# EasyEDA Pro project PowerControl.eprj

# Schematic Schematic16
Create Date: 2024-04-26; Page Name: P1; Project Name: PowerControl; Schematic Name: Schematic16; Update Date: 2024-07-27; Company: 嘉立创EDA; Page Size: A4; Version: V1.0
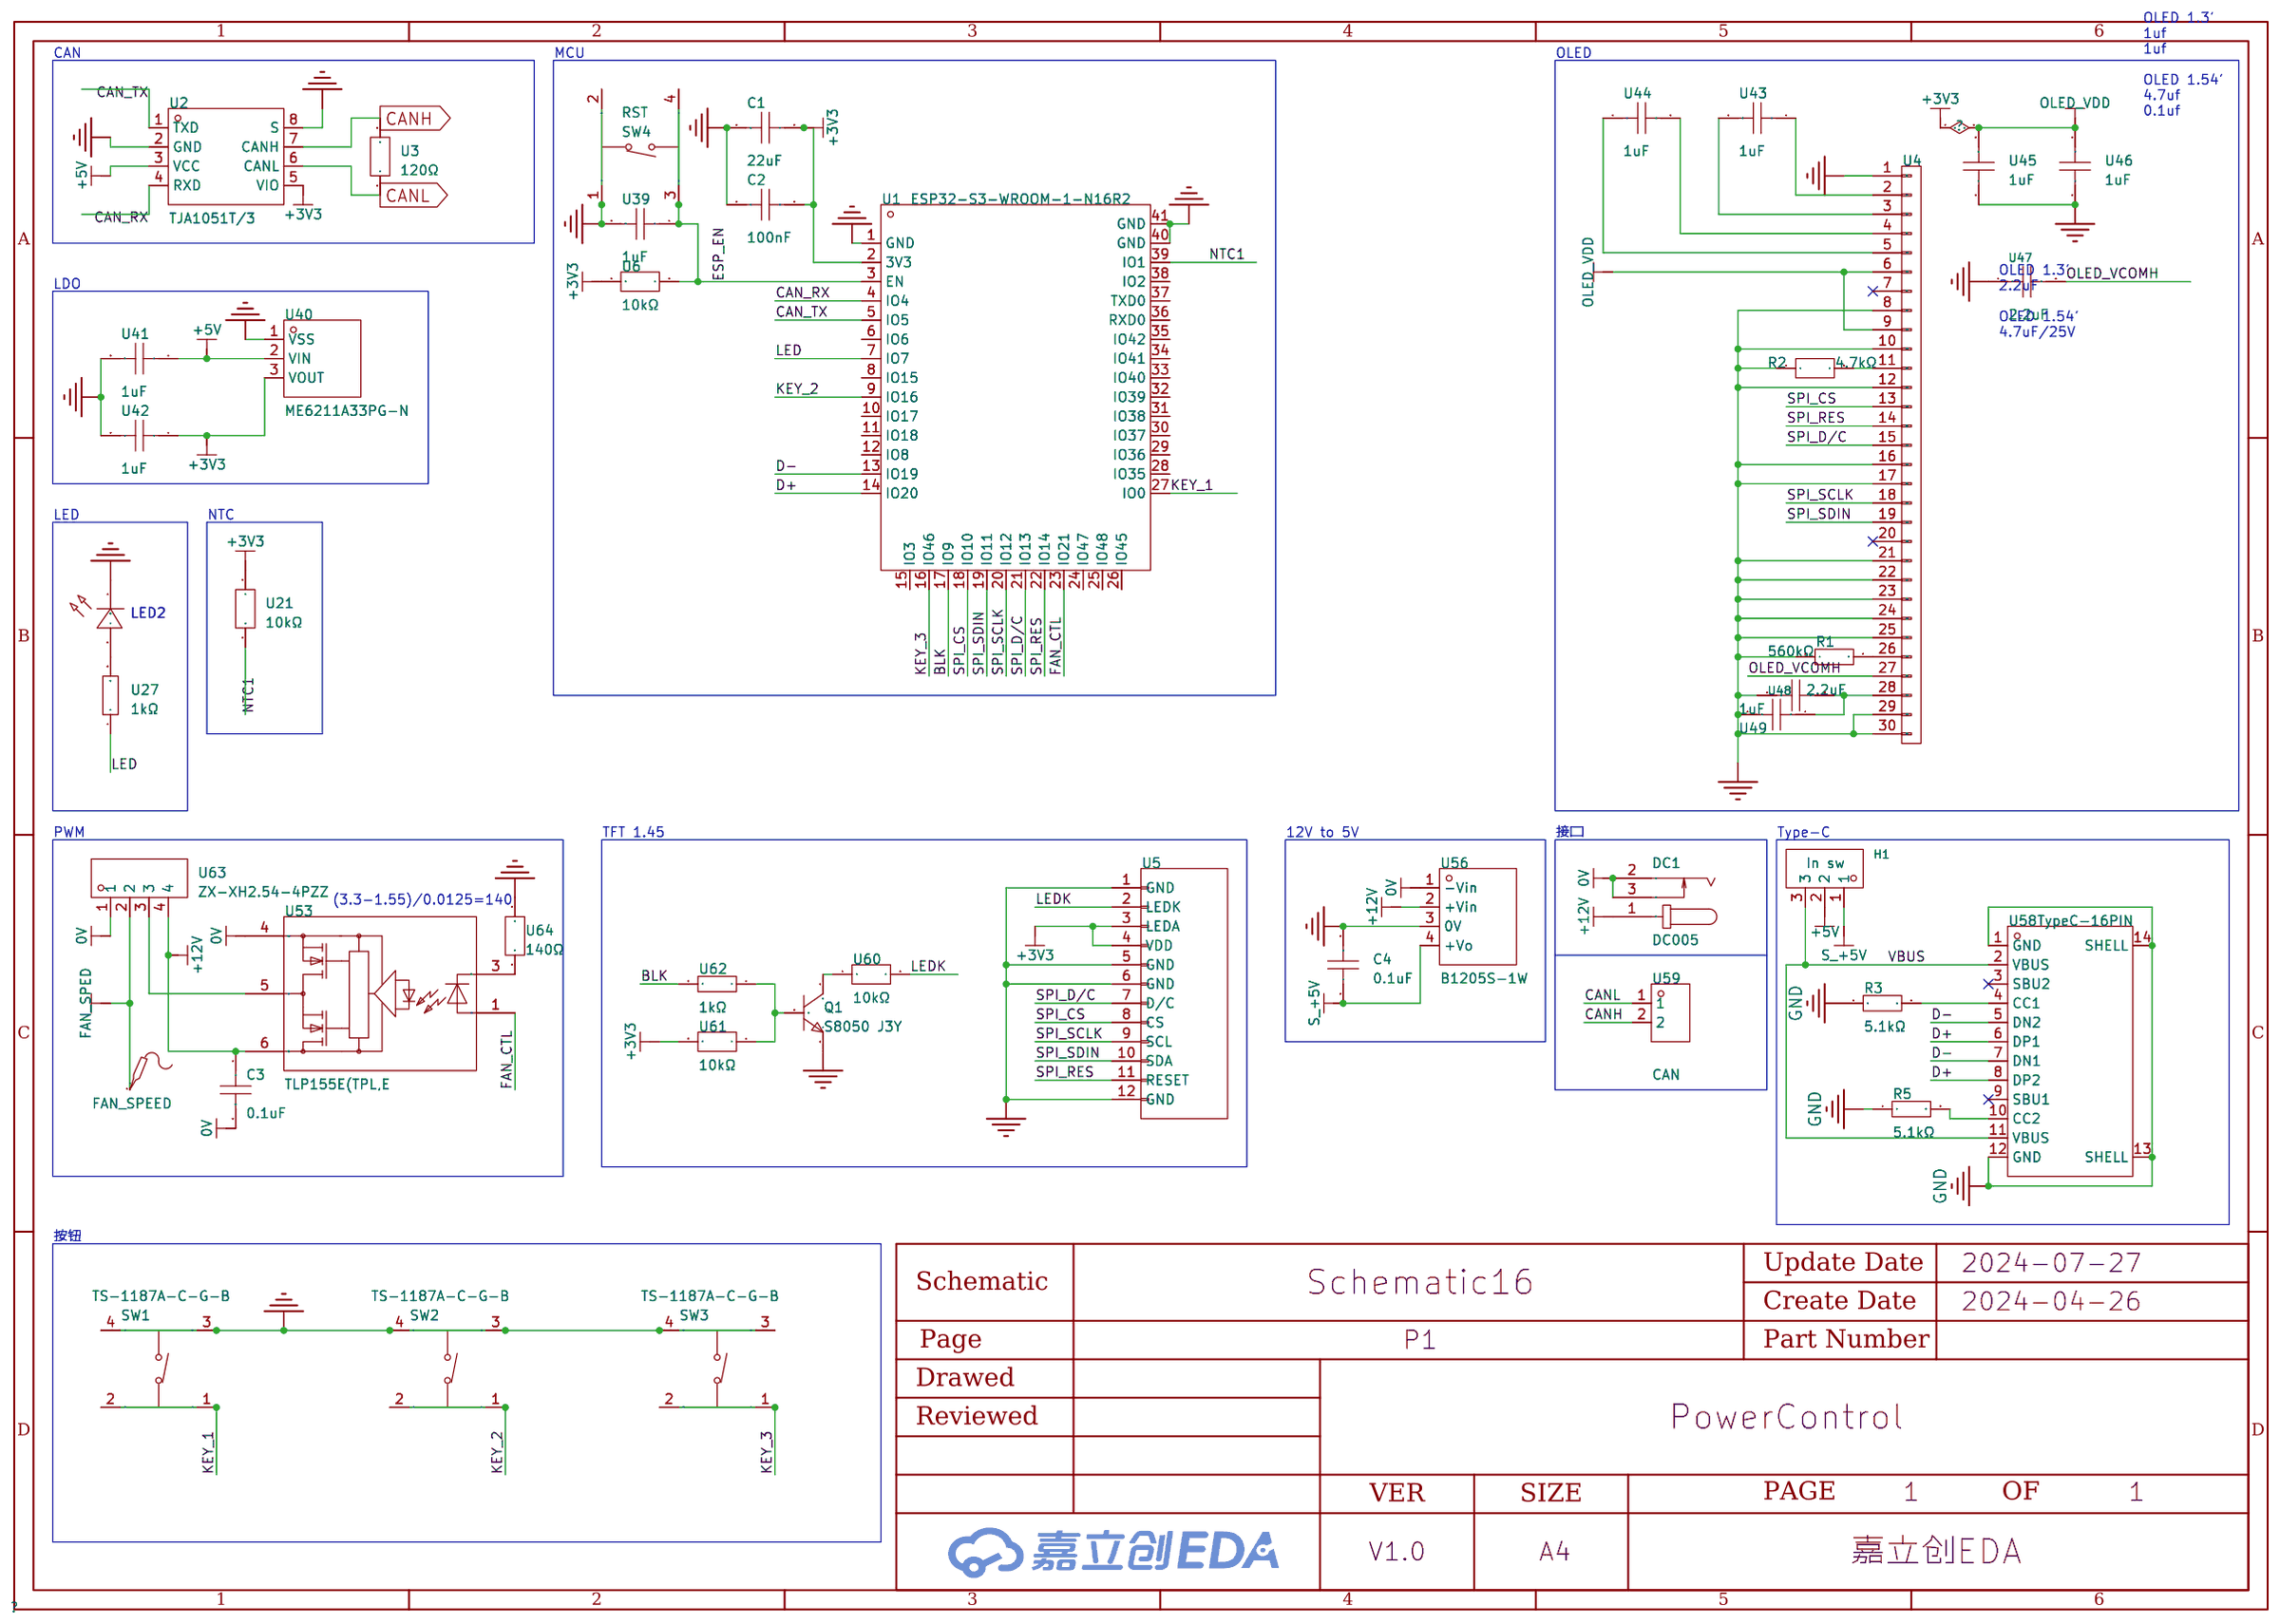
[diagram p0: schematic sheet]

## Parts
C1  22uF  [C0805]
C2  100nF  [C0603]
C3  0.1uF  [C0603]
C4  0.1uF  [C0603]
DC1  DC005  [DC-IN-TH_DC005]
FAN_SPEED  -  [Test-Point-0.5mm]
H1  In sw  [HDR-TH_3P-P2.54-V-M]
LED2  -  [LED_0805]
Q1  S8050 J3Y  [SOT-23-3_L3.0-W1.7-P0.95-LS2.9-BR]
R1  560kΩ  [R0805]
R2  4.7kΩ  [R0805]
R3  5.1kΩ  [R0402]
R5  5.1kΩ  [R0402]
SW1  TS-1187A-C-G-B  [SW-SMD_4P-L5.1-W5.1-P3.70-LS6.4]
SW2  TS-1187A-C-G-B  [SW-SMD_4P-L5.1-W5.1-P3.70-LS6.4]
SW3  TS-1187A-C-G-B  [SW-SMD_4P-L5.1-W5.1-P3.70-LS6.4]
SW4  RST  [SW-SMD_4P-L5.1-W5.1-P3.70-LS6.4]
U1  ESP32-S3-WROOM-1-N16R2  [WIRELM-SMD_ESP32-S3-WROOM-1]
U2  TJA1051T/3  [SOP-8_L4.9-W3.9-P1.27-LS6.0-BL-1]
U3  120Ω  [R0805]
U4  -  [Conn_01x30]
U5  -  [TFT_1.54_12P]
U6  10kΩ  [R0805]
U21  10kΩ  [R0805]
U27  1kΩ  [R0805]
U39  1uF  [C0805]
U40  ME6211A33PG-N  [SOT-89_L4.5-W2.5-P1.50-LS4.2-BR]
U41  1uF  [C0805]
U42  1uF  [C0805]
U43  1uF  [C0805]
U44  1uF  [C0805]
U45  1uF  [C0805]
U46  1uF  [C0805]
U47  2.2uF  [C0805]
U48  2.2uF  [C0805]
U49  1uF  [C0805]
U53  TLP155E(TPL,E  [OPTO-SMD-5_L3.7-W4.6-P1.27-LS7.0-BR]
U56  B1205S-1W  [PWRM-TH_BXXXXS-1W]
U58  TypeC-16PIN  [USB-C-SMD_TYPE-C-6PIN-2MD-073]
U59  CAN  [CONN-TH_DB301V-3.5-2P-GN]
U60  10kΩ  [R0805]
U61  10kΩ  [R0805]
U62  1kΩ  [R0805]
U63  ZX-XH2.54-4PZZ  [CONN-TH_4P-P2.50_4PIN]
U64  140Ω  [R0603]

## Library data of the parts
C1 = C2012JB1A226M085AC: 容值:22uF;额定电压:10V;材质(温度系数):JB;; LCSC Part Name: 22uF 10V; Supplier Part: C3909090; Manufacturer: TDK; JLCPCB Part Class: 扩展库; Supplier: LCSC; Voltage Rated: 10V; Temperature Coefficient: JB
C2 = CGA3E3X8R1H104M080AB: 容值:100nF;精度:±20%;额定电压:50V;; LCSC Part Name: 100nF ±20% 50V; Supplier Part: C193709; Manufacturer: TDK; Supplier Footprint: 0603; Datasheet: https://atta.szlcsc.com/upload/public/pdf/source/20200407/C342975_AB13C551805E4B495BBDB585D2C58CA0.pdf; Supplier: LCSC; Tolerance: ±20%; Voltage Rated: 50V
C3 C4 = 0603BB104K500NGT: 容值:0.1uF;精度:±10%;额定电压:50V;温度系数:-;; LCSC Part Name: 0.1uF ±10% 50V; Supplier Part: C2168571; Manufacturer: Knowles(楼氏); Supplier Footprint: 0603; JLCPCB Part Class: 扩展库; Datasheet: https://atta.szlcsc.com/upload/public/pdf/source/20210426/55B82DB4A9EC19DEFEE13887341FCC08.pdf; Supplier: LCSC; Tolerance: ±10%; Voltage Rated: 50V
DC1 = DC005: 连接器类型:DC电源插座;安装方式:弯插;触点内径:2mm;触点外径:6.3mm;额定电流:500mA;额定电压:30V;工作温度范围:-40℃~+55℃;; LCSC Part Name: DC电源插座 内径:2mm 外径:6.3mm; Supplier Part: C431533; Manufacturer: SHOU HAN(首韩); Supplier Footprint: 插件; Datasheet: https://atta.szlcsc.com/upload/public/pdf/source/20190925/C431533_4751811035784AC1D38EBC85F7905E99.pdf; Supplier: LCSC; Connector Type: DC电源插座; Mounting Style: 弯插; Inside Contact Diameter: 2mm; Outside Contact Diameter: 6.3mm; Current Rating (Max): 500mA; Voltage Rating (Max): 30V; Operating Temperature Range: -40℃~+55℃
FAN_SPEED = Test-Point: Test Point 测试点
H1 = PZ254V-11-03P: 插针结构:1x3P;间距:2.54mm;行距:-;圆针/方针:方针;安装类型:直插;排数:单排;总PIN位数:3P;额定电流:3A;额定电压:250V;配合针长度:6mm;塑高:2.5mm;端接针长度:3mm;工作温度范围:-40℃~+105℃;颜色:黑色;; LCSC Part Name: 间距:2.54mm 1x3P 直插 方针; Supplier Part: C2937625; Manufacturer: XFCN(兴飞); Supplier Footprint: 插件,P=2.54mm; Datasheet: https://atta.szlcsc.com/upload/public/pdf/source/20200309/C492402_8335C3D49C4E4C618838D59BB1D024C1.pdf; Supplier: LCSC; Pin Structure: 1x3P; Pitch: 2.54mm; Circluar Pins/Square Pins: 方针; Mounting Type: 直插; Number of Rows: 单排; Number of Pins: 3P; Current Rating (Max): 3A; Voltage Rating (Max): 250V; Length of Mating Pin: 6mm; Insulation Height: 2.5mm; Length of End Connection Pin: 3mm; Operating Temperature Range: -40℃~+105℃; Color: 黑色
LED2 = LED_0805-G: Supplier Footprint: 0805
Q1 = S8050 J3Y_C2146: 晶体管类型:NPN;集电极电流(Ic):500mA;集射极击穿电压(Vceo):25V;功率(Pd):300mW;直流电流增益(hFE@Ic,Vce):200@50mA,1V;; LCSC Part Name: S8050 J3Y(RANGE:200-350) H档(200-350); Supplier Part: C2146; Manufacturer: CJ(江苏长电/长晶); Supplier Footprint: SOT-23; JLCPCB Part Class: 基础库; Datasheet: https://atta.szlcsc.com/upload/public/pdf/source/20140809/1457707209234.pdf; Supplier: LCSC; Transistor Type: NPN; Collector Current (Ic): 500mA; Collector-Emitter Breakdown Voltage (Vceo): 25V; Power Dissipation (Pd): 300mW; DC Current Gain (hFE@Ic,Vce): 200@50mA,1V; Transition Frequency (fT): 150MHz; Collector Cut-Off Current (Icbo): 100nA; Collector-Emitter Saturation Voltage (VCE(sat)@Ic,Ib): 600mV@500mA,50mA
R1 = 0805W8F5603T5E: 电阻类型:厚膜电阻;阻值:560kΩ;精度:±1%;功率:125mW;; LCSC Part Name: 560kΩ ±1% 125mW; Supplier Part: C15785; Manufacturer: UNI-ROYAL(厚声); Supplier Footprint: 0805; JLCPCB Part Class: 扩展库; Datasheet: https://atta.szlcsc.com/upload/public/pdf/source/20200306/C422600_1E6D84923E4A46A82E41ADD87F860B5C.pdf; Supplier: LCSC; Type: 厚膜电阻; Tolerance: ±1%; Power(Watts): 125mW; Temperature Coefficient: ±100ppm/℃; Overload Voltage (Max): 150V; Operating Temperature Range: -55℃~+155℃
R2 = CRCW08054K70FKEAHP: 电阻类型:厚膜电阻;阻值:4.7kΩ;精度:±1%;功率:500mW;; LCSC Part Name: 4.7kΩ ±1% 500mW; Supplier Part: C313926; Manufacturer: VISHAY(威世); Supplier Footprint: 0805; JLCPCB Part Class: 扩展库; Datasheet: https://atta.szlcsc.com/upload/public/pdf/source/20210128/C313329_30EDDB0DCE34428579C0BE4C994F6084.pdf; Supplier: LCSC; Type: 厚膜电阻; Tolerance: ±1%; Power(Watts): 500mW; Temperature Coefficient: ±100ppm/K; Overload Voltage (Max): 150V; Operating Temperature Range: -55℃~+155℃
R3 R5 = RC0402FR-075K1L: 阻值:5.1kΩ;精度:±1%;功率:62.5mW;温度系数:±100ppm/℃;最大工作电压:50V;工作温度范围:-55℃~+155℃;; LCSC Part Name: 5.1kΩ ±1% 62.5mW; Supplier Part: C105872; Manufacturer: YAGEO(国巨); Supplier Footprint: 0402; JLCPCB Part Class: Extended Part; Datasheet: https://atta.szlcsc.com/upload/public/pdf/source/20170912/C105872_1505207464555963229.pdf; Supplier: LCSC; Tolerance: ±1%; Power(Watts): 62.5mW; Temperature Coefficient: ±100ppm/℃; Overload Voltage (Max): 50V; Operating Temperature Range: -55℃~+155℃
SW1-SW4 = TS-1187A-C-G-B: 触点电流:50mA;额定电压(DC):12V;绝缘电阻:-;电路结构:单刀单掷;安装方式:立贴;带灯:无;作用力:260gf;机械寿命:10万次;带支架:否;; LCSC Part Name: 立贴 5.1*5.1*3.5mm 轻触开关; Supplier Part: C318886; Manufacturer: XKB Connectivity(中国星坤); Supplier Footprint: SMD; JLCPCB Part Class: Extended Part; Datasheet: https://atta.szlcsc.com/upload/public/pdf/source/20211011/CF465E46D2427DB66E133733EF19F823.pdf; Supplier: LCSC; Contact Current: 50mA; Voltage Rating (DC): 12V; Circuit: 单刀单掷; Mounting Style: 立贴; Actuator Style: 圆形按钮; Actuator/Cap Color: 金色; With Lamp: 无; Operating Force: 260gf; Mechanical Life: 10万次; Operating Temperature: -30℃~+85℃; Switch Length: 5.1mm; Switch Width: 5.1mm; Switch Height: 3.5mm; Strike Gundam: 否
U1 = ESP32-S3-WROOM-1-N16R2: Supplier Part: C2913205; Manufacturer: ESPRESSIF(乐鑫); Supplier Footprint: SMD; JLCPCB Part Class: 扩展库; Datasheet: https://atta.szlcsc.com/upload/public/pdf/source/20220628/A2AC12B3C87735CAEB7EBE2DBE80936C.pdf; Supplier: LCSC
U2 = TJA1051T/3: LCSC Part Name: CAN芯片; Supplier Part: C5342108; Manufacturer: Tokmas(托克马斯); Supplier Footprint: SOP-8; JLCPCB Part Class: Extended Part; Datasheet: https://atta.szlcsc.com/upload/public/pdf/source/20221230/A2F88B671123D34174A4F40D8F54A86B.pdf; Supplier: LCSC
U3 = CRCW0805120RJNEA: 电阻类型:厚膜电阻;阻值:120Ω;精度:±5%;功率:125mW;; LCSC Part Name: 120Ω ±5% 125mW; Supplier Part: C2091982; Manufacturer: VISHAY(威世); Supplier Footprint: 0805; JLCPCB Part Class: 扩展库; Datasheet: https://atta.szlcsc.com/upload/public/pdf/source/20210503/4CAD3FA9B4C9A749933C1C52DBF827C2.pdf; Supplier: LCSC; Type: 厚膜电阻; Tolerance: ±5%; Power(Watts): 125mW; Temperature Coefficient: ±200ppm/℃; Overload Voltage (Max): 150V; Operating Temperature Range: -55℃~+155℃
U4 = Conn_01x30
U5 = TFT_1.54_12P
U6 U21 U60 U61 = CRG0805F10K/10: 电阻类型:厚膜电阻;阻值:10kΩ;精度:±1%;功率:125mW;; LCSC Part Name: 10kΩ ±1% 125mW; Supplier Part: C2090476; Manufacturer: TE Connectivity(美国泰科); Supplier Footprint: 0805; JLCPCB Part Class: 扩展库; Datasheet: https://atta.szlcsc.com/upload/public/pdf/source/20210608/D95D7196C11938F01E5013E79A9A3DFC.pdf; Supplier: LCSC; Type: 厚膜电阻; Tolerance: ±1%; Power(Watts): 125mW; Temperature Coefficient: ±100ppm/℃; Overload Voltage (Max): 150V; Operating Temperature Range: -55℃~+155℃
U27 U62 = RC0805JR-131KL: 阻值:1kΩ;精度:±5%;; LCSC Part Name: 1kΩ ±5%; Supplier Part: C4115774; Manufacturer: YAGEO(国巨); Supplier Footprint: 0805; JLCPCB Part Class: Extended Part; Supplier: LCSC; Tolerance: ±5%
U39 U41-U46 U49 = CGA4J3X7S2A105KT0Y0S: 容值:1uF;精度:±10%;额定电压:100V;材质(温度系数):-;; LCSC Part Name: 1uF ±10% 100V; Supplier Part: C445697; Manufacturer: TDK; Supplier Footprint: 0805; JLCPCB Part Class: Extended Part; Datasheet: https://atta.szlcsc.com/upload/public/pdf/source/20191220/C445697_C68E33B76B2E5DBDF084EECE5EEE069C.pdf; Supplier: LCSC; Tolerance: ±10%; Voltage Rated: 100V
U40 = ME6211A33PG-N: 输出类型:固定;输出极性:正;输出通道数:1;最大输入电压:6V;输出电压:3.3V;压差:260mV@(200mA);输出电流:500mA;电源纹波抑制比(PSRR):70dB;; LCSC Part Name: 正 Vin=6V Vout=3.3V 500mA 70dB; Supplier Part: C236673; Manufacturer: MICRONE(南京微盟); Supplier Footprint: SOT-89-3; JLCPCB Part Class: 扩展库; Datasheet: https://atta.szlcsc.com/upload/public/pdf/source/20180709/C236673_601B1320BBD467EDA9C49E7074655B8F.pdf; Supplier: LCSC; Output Type: 固定; Output Polarity: 正; Number of Outputs: 1; Maximum Input Voltage: 6V; Output Voltage: 3.3V; Dropout Voltage: 260mV@(200mA); Output Current: 500mA; Power Supply Rejection Ratio (PSRR): 70dB
U47 U48 = CGB4B3JB1A225K055AB: 容值:2.2uF;精度:±10%;额定电压:10V;材质(温度系数):JB;; LCSC Part Name: 2.2uF ±10% 10V; Supplier Part: C3845313; Manufacturer: TDK; Supplier Footprint: 0805; Supplier: LCSC; Tolerance: ±10%; Voltage Rated: 10V; Temperature Coefficient: JB
U53 = TLP155E(TPL,E: Supplier Part: C56499; Manufacturer: TOSHIBA(东芝); Supplier Footprint: SO-5; JLCPCB Part Class: Extended Part; Datasheet: https://atta.szlcsc.com/upload/public/pdf/source/20150821/1457707350132.pdf; Supplier: LCSC
U56 = B1205S-1W: 转换类型:DC-DC;是否隔离稳压:隔离非稳压;输出路数:1;输入电压(DC):10.8V~13.2V;输出电压:5V;输出电流(最大值):200mA;输出功率:1W;转换效率:83%;最大容性负载:22uF;; LCSC Part Name: Vin=10.8V~13.2V Vout=5V 200mA; Supplier Part: C512041; Manufacturer: rlt; Supplier Footprint: 插件; JLCPCB Part Class: 扩展库; Datasheet: https://atta.szlcsc.com/upload/public/pdf/source/20200413/C512032_84304DFF2D79E4C432AD9335328BE313.pdf; Supplier: LCSC; Conversion Type: DC-DC; Function: 降压型; Isolated Or Voltage Regulation: 隔离非稳压; Output Channel: 1; Input Voltage(DC): 10.8V~13.2V; Output Voltage: 5V; Output Current (Max): 200mA; Output Power: 1W; Insulated Voltage: 1kV; Conversion Efficiency: 83%; Maximum capacitive load: 22uF
U58 = TypeC-16PIN: Supplier Part: C9900016187; JLCPCB Part Class: Extended Part; Datasheet: 2022-04-26/182445A/86ade1b3bc5841688e69f2c7e7e4613d/TYPEC母座.pdf; Supplier: LCSC
U59 = DB301V-3.5-2P-GN-S: 结构:1x2P;间距:3.5mm;颜色:绿色;安装方式:直插;额定电流:10A;额定电压:130V;排数:1;线规 - AWG:18~24;线规 - 平方毫米:0.5~1;每排PIN数:2;工作温度范围:-40℃~+105℃;; LCSC Part Name: 3.5mm 1x2P 排数:1 每排P数:2 直插; Supplier Part: C695629; Manufacturer: DORABO(地博电气); Supplier Footprint: 插件,P=3.5mm; Datasheet: https://atta.szlcsc.com/upload/public/pdf/source/20230106/1B95616A85A883CA085E21635C8A8490.pdf; Supplier: LCSC; Structure: 1x2P; Pitch: 3.5mm; Color: 绿色; Mounting Style: 直插; Current Rating (Max): 10A; Voltage Rating (Max): 130V; Number of Pins: 2P; Number of Rows: 1; Wire Gauge - AWG: 18~24; Wire Gauge - mm2: 0.5~1; Number of PINs Per Row: 2; Operating Temperature Range: -40℃~+105℃
U63 = ZX-XH2.54-4PZZ: 插针结构:1x4P;间距:2.54mm;安装方式:直插;参考系列:XH;总PIN数:4P;排数:1;每排PIN数:4;行距:-;额定电流:3A;触头材质:黄铜;触头镀层:锡;工作温度范围:-25℃~+85℃;; Supplier Part: C7429634; Manufacturer: Megastar(兆星); Supplier Footprint: 插件,P=2.54mm; JLCPCB Part Class: Extended Part; Datasheet: https://atta.szlcsc.com/upload/public/pdf/source/20230619/B529A2163E0159A644AB3383D208FB03.pdf; Supplier: LCSC; Pins Structure: 1x4P; Pitch: 2.54mm; Mounting Style: 直插; Reference Series: XH; Number of Pins: 4P; Number of Rows: 1; Number of PINs Per Row: 4; Current Rating (Max): 3A; Contact Material: 黄铜; Contact Plating: 锡; Operating Temperature Range: -25℃~+85℃
U64 = FRC0603F1400TS: 电阻类型:厚膜电阻;阻值:140Ω;精度:±1%;功率:100mW;最大工作电压:75V;温度系数:±100ppm/℃;; LCSC Part Name: 140Ω ±1% 100mW 厚膜电阻; Supplier Part: C2974027; Manufacturer: FOJAN(富捷); Supplier Footprint: 0603; JLCPCB Part Class: 扩展库; Datasheet: https://atta.szlcsc.com/upload/public/pdf/source/20211221/925EC7D7225764EE0046F22065062C87.pdf; Supplier: LCSC; Type: 厚膜电阻; Tolerance: ±1%; Power(Watts): 100mW; Overload Voltage (Max): 75V; Temperature Coefficient: ±100ppm/℃; Operating Temperature Range: -55℃~+155℃

## Nets
0V: C3.2 DC1.2 DC1.3 U53.4(GND) U56.1(-Vin) U63.1
+3V3: C1.1 C2.2 U1.2(3V3) U2.5(VIO) U4.6(Pin) U4.9(Pin) U5.3(LEDA) U5.4(VDD) U6.1 U21.1 U40.3(VOUT) U42.1 U45.2 U46.2 U61.2
+5V: H1.2 U2.3(VCC) U40.2(VIN) U41.1
+12V: C3.1 DC1.1 U53.6(VCC) U56.2(+Vin) U63.4
GND: C1.2 C2.1 C4.2 LED2.1(C) Q1.2(E) R1.1 R2.1 R3.1 R5.1 SW1.3(C) SW1.4(D) SW2.3(C) SW2.4(D) SW3.3(C) SW3.4(D) SW4.1(A) SW4.2(B) U1.1(GND) U1.40(GND) U1.41(GND) U2.2(GND) U2.8(S) U4.1(Pin) U4.8(Pin) U4.10(Pin) U4.12(Pin) U4.16(Pin) U4.17(Pin) U4.21(Pin) U4.22(Pin) U4.23(Pin) U4.24(Pin) U4.25(Pin) U4.29(Pin) U4.30(Pin) U5.1(GND) U5.5(GND) U5.6(GND) U5.12(GND) U39.2 U40.1(VSS) U41.2 U42.2 U45.1 U46.1 U47.1 U48.1 U49.2 U56.3(0V) U58.1(GND) U58.12(GND) U58.13(SHELL) U58.14(SHELL) U64.2
VBUS: H1.3 U58.2(VBUS) U58.11(VBUS)
BLK: U1.17(IO9) U62.2
CAN_RX: U1.4(IO4) U2.4(RXD)
CAN_TX: U1.5(IO5) U2.1(TXD)
CANH: U2.7(CANH) U3.2 U59.2
CANL: U2.6(CANL) U3.1 U59.1
D+: U1.14(IO20) U58.6(DP1) U58.8(DP2)
D-: U1.13(IO19) U58.5(DN2) U58.7(DN1)
ESP_EN: SW4.3(C) SW4.4(D) U1.3(EN) U6.2 U39.1
FAN_CTL: U1.23(IO21) U53.1(AN)
FAN_SPED: FAN_SPEED.1 U63.2
KEY_1: SW1.1(A) SW1.2(B) U1.27(IO0)
KEY_2: SW2.1(A) SW2.2(B) U1.9(IO16)
KEY_3: SW3.1(A) SW3.2(B) U1.16(IO46)
LED: U1.7(IO7) U27.1
LEDK: U5.2(LEDK) U60.2
NTC1: U1.39(IO1) U21.2
OLED_VCOMH: U4.27(Pin) U47.2
S_+5V: C4.1 H1.1 U56.4(+Vo)
SPI_CS: U1.18(IO10) U4.13(Pin) U5.8(CS)
SPI_D/C: U1.21(IO13) U4.15(Pin) U5.7(D/C)
SPI_RES: U1.22(IO14) U4.14(Pin) U5.11(RESET)
SPI_SCLK: U1.20(IO12) U4.18(Pin) U5.9(SCL)
SPI_SDIN: U1.19(IO11) U4.19(Pin) U5.10(SDA)
$1N1911: U4.2(Pin) U43.1
$1N1912: U4.3(Pin) U43.2
$1N1913: U4.4(Pin) U44.2
$1N1914: U4.5(Pin) U44.1
$1N1920: R1.2 U4.26(Pin)
$1N1926: U4.28(Pin) U48.2 U49.1
$1N1927: R2.2 U4.11(Pin)
$1N1975: LED2.2(A) U27.2
$1N2447: U53.5(VO) U63.3
$1N3071: R3.2 U58.4(CC1)
$1N3072: R5.2 U58.10(CC2)
$1N9419: Q1.3(C) U60.1
$1N9466: Q1.1(B) U61.1 U62.1
$1N12402: U53.3(CAT) U64.1

Not connected (* = marked no-connect by the designer): U1 6(IO6) 8(IO15) 10(IO17) 11(IO18) 12(IO8) 15(IO3) 24(IO47) 25(IO48) 26(IO45) 28(IO35) 29(IO36) 30(IO37) 31(IO38) 32(IO39) 33(IO40) 34(IO41) 35(IO42) 36(RXD0) 37(TXD0) 38(IO2); U4 7(Pin)* 20(Pin)*; U58 3(SBU2)* 9(SBU1)*

## Notes on the sheet
- CAN
- MCU
- OLED
- OLED 1.3'
  1uf
  1uf
  OLED 1.54'
  4.7uf
  0.1uf
- LDO
- OLED 1.3'
  2.2uF
  OLED 1.54'
  4.7uF/25V
- LED
- NTC
- PWM
- TFT 1.45
- 12V to 5V
- 接口
- Type-C
- (3.3-1.55)/0.0125=140
- 按钮

# Board PCB26
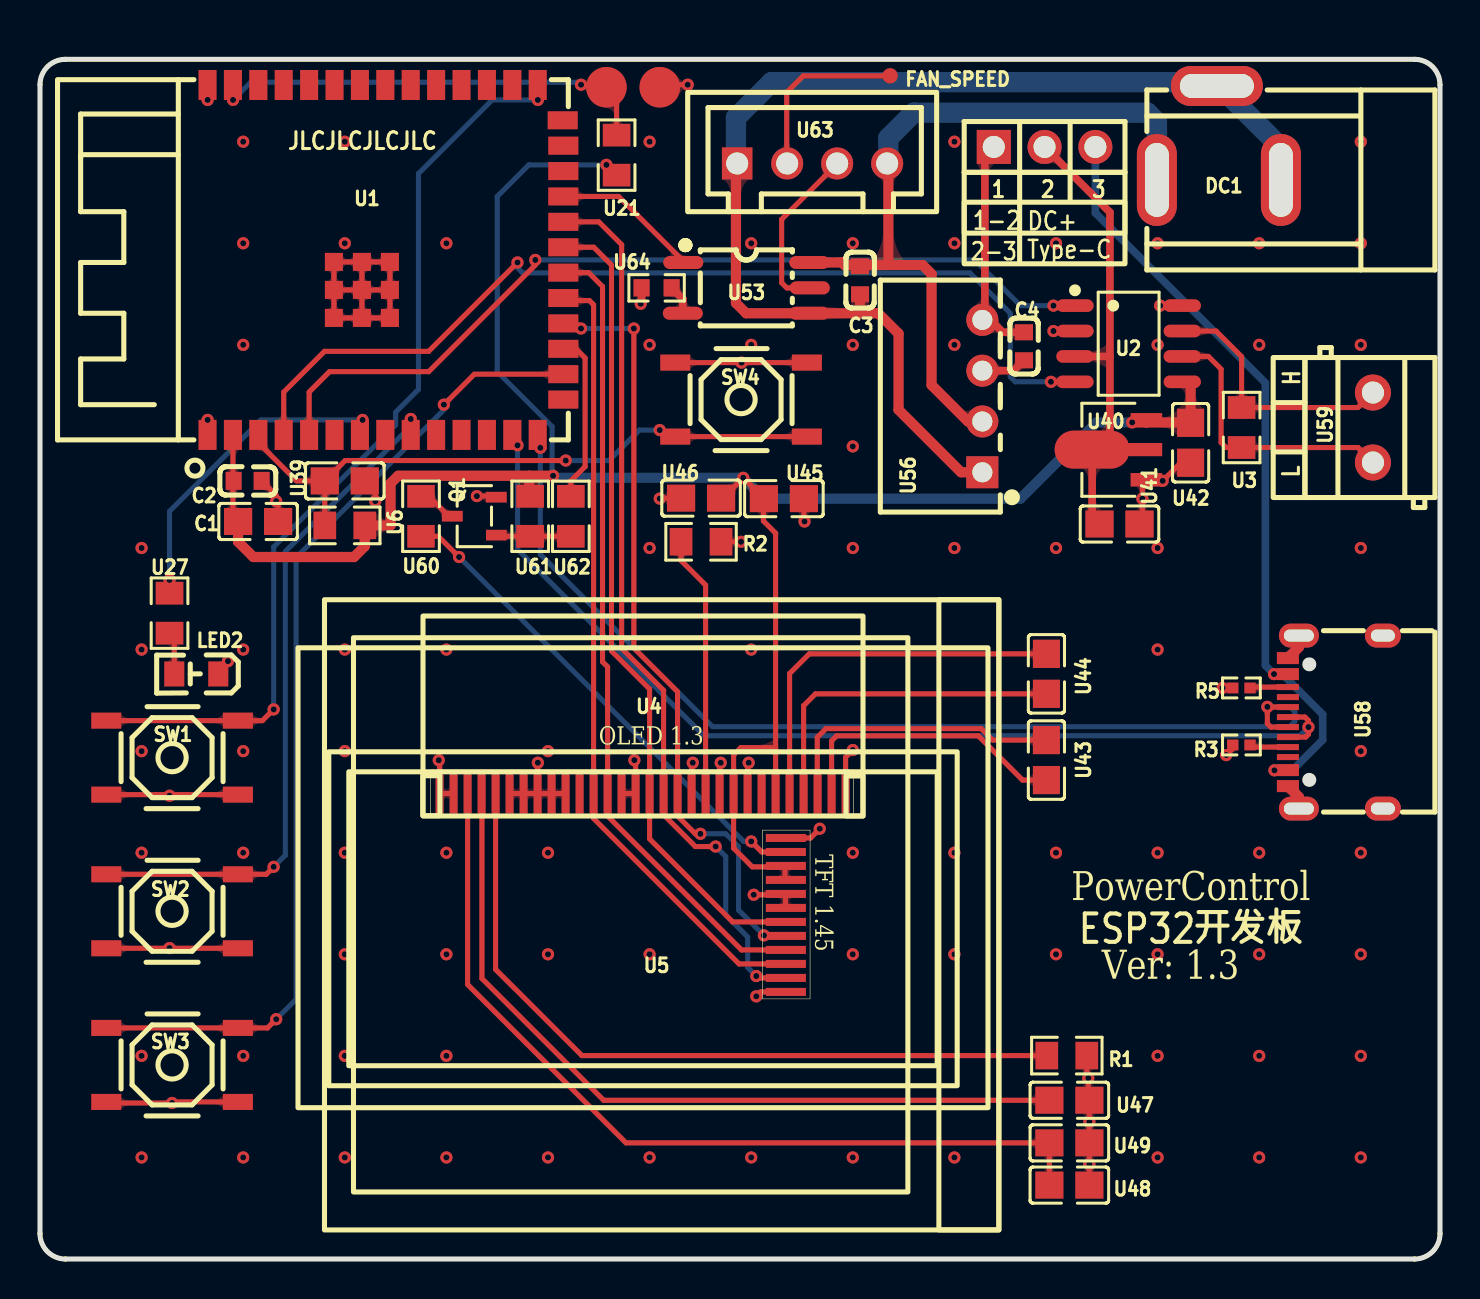
[diagram p1: board, top side]
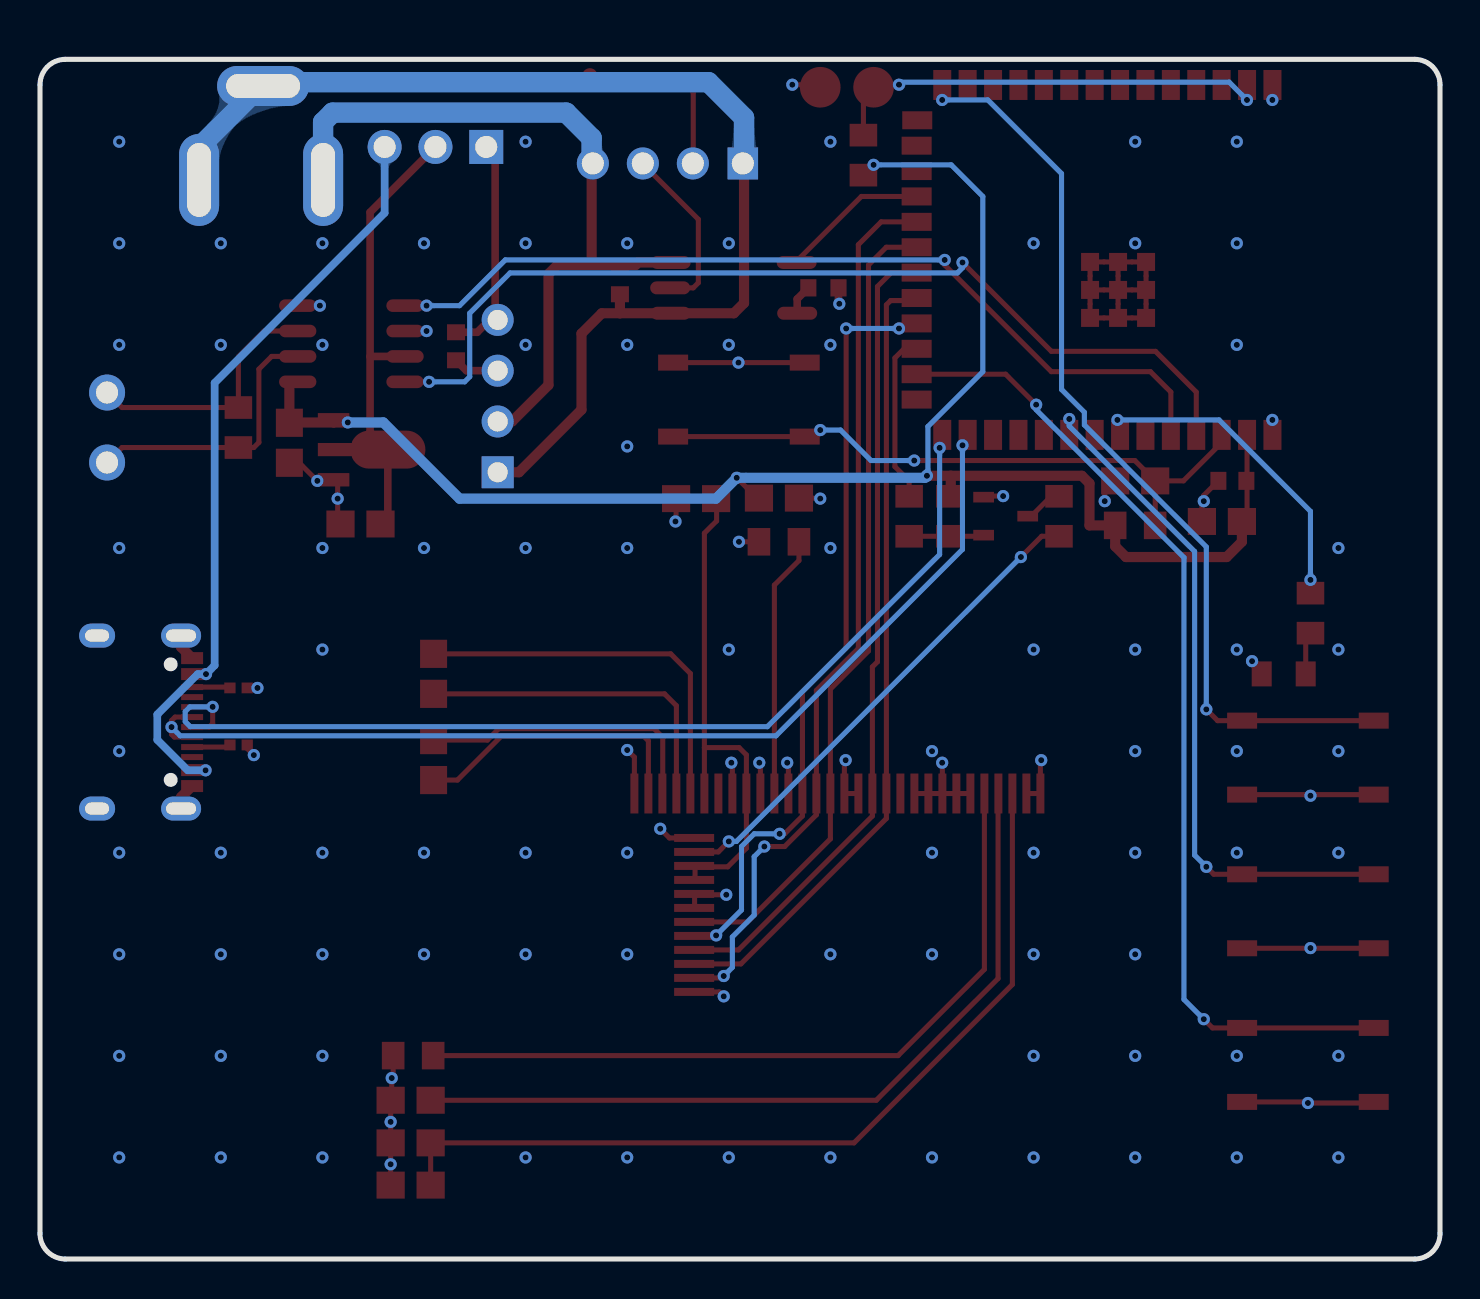
[diagram p2: board, bottom side, seen from below]

Outline 70 x 60 mm; copper layers: Top Layer, Bottom Layer. Coordinates in mm from the lower left corner of the outline.
Outline path: 0,58.73 0,1.27 arc(0.37,0.37) 1.27,0 68.73,0 arc(69.63,0.37) 70,1.27 70,58.73 arc(69.63,59.63) 68.73,60 1.27,60 arc(0.37,59.63) 0,58.73
Stack: Top Layer 0.035mm / Dielectric1 1.51mm FR4 er 4.5 / Bottom Layer 0.035mm

## Design rules (mm)
net D-: USB
net D+: USB
template: JLCPCB Capability(Two Layers Board)
spacing copperThickness1oz (default): track to track 0.102, other pairs 0.152 to 0.3
spacing copperThickness2oz: track to track 0.203, other pairs 0.152 to 0.3
track width copperThickness1oz (default): min 0.127, default 0.254, max 2.54
track width copperThickness2oz: min 0.203, default 0.254, max 2.54
differential pair differentialPair (default): width min 0.127, default 0.254, max 2.54; gap min 0.152, default 0.152
via viaSize (default): diameter min 0.5, default 0.61, max 10; hole min 0.3, default 0.305, max 6.3

## Placement (name value [footprint] x y rotation side)
C1  22uF  [C0805]  10.91 36.89 0 top
C2  100nF  [C0603]  10.38 38.92 180 top
C3  0.1uF  [C0603]  41 48.95 270 top
C4  0.1uF  [C0603]  49.2 45.65 270 top
DC1  DC005  [DC-IN-TH_DC005]  58.94 56.32 180 top
FAN_SPEED  -  [test-point-0.5mm]  42.51 59.18 0 top
H1  In sw  [HDR-TH_3P-P2.54-V-M]  50.23 55.62 0 top
LED2  -  [LED_0805]  7.76 29.27 180 top
NOREF  -  [Pad_e93]  28.32 58.6 0 top
NOREF#2  -  [Pad_e132]  30.99 58.6 0 top
Q1  S8050 J3Y  [SOT-23-3_L3.0-W1.7-P0.95-LS2.9-BR]  21.72 37.15 0 top
R1  560kΩ  [R0805]  51.34 10.17 180 top
R2  4.7kΩ  [R0805]  33.05 35.87 180 top
R3  5.1kΩ  [R0402]  60.07 25.71 0 top
R5  5.1kΩ  [R0402]  60.07 28.56 0 top
SW1  TS-1187A-C-G-B  [SW-SMD_4P-L5.1-W5.1-P3.70-LS6.4]  6.6 25.08 0 top
SW2  TS-1187A-C-G-B  [SW-SMD_4P-L5.1-W5.1-P3.70-LS6.4]  6.6 17.39 0 top
SW3  TS-1187A-C-G-B  [SW-SMD_4P-L5.1-W5.1-P3.70-LS6.4]  6.6 9.71 0 top
SW4  RST  [SW-SMD_4P-L5.1-W5.1-P3.70-LS6.4]  35.05 42.98 0 top
U1  ESP32-S3-WROOM-1-N16R2  [WIRELM-SMD_ESP32-S3-WROOM-1]  17.27 49.97 90 top
U2  TJA1051T/3  [SOP-8_L4.9-W3.9-P1.27-LS6.0-BL-1]  54.43 45.78 270 top
U3  120Ω  [R0805]  60.08 41.58 90 top
U4  -  [Conn_01x30]  40.64 22.03 180 top
U5  -  [TFT_1.54_12P]  14.22 1.45 90 top
U6  10kΩ  [R0805]  15.24 36.69 180 top
U21  10kΩ  [R0805]  28.83 55.21 90 top
U27  1kΩ  [R0805]  6.48 32.3 270 top
U39  1uF  [C0805]  15.24 38.92 0 top
U40  ME6211A33PG-N  [SOT-89_L4.5-W2.5-P1.50-LS4.2-BR]  53.96 40.47 0 top
U41  1uF  [C0805]  53.97 36.76 0 top
U42  1uF  [C0805]  57.53 40.82 270 top
U43  1uF  [C0805]  50.32 24.95 90 top
U44  1uF  [C0805]  50.32 29.27 270 top
U45  1uF  [C0805]  37.19 38.03 180 top
U46  1uF  [C0805]  33.05 38.05 0 top
U47  2.2uF  [C0805]  51.47 7.94 180 top
U48  2.2uF  [C0805]  51.47 3.7 180 top
U49  1uF  [C0805]  51.47 5.81 0 top
U53  TLP155E(TPL,E  [OPTO-SMD-5_L3.7-W4.6-P1.27-LS7.0-BR]  35.32 48.57 180 top
U56  B1205S-1W  [PWRM-TH_BXXXXS-1W]  47.12 43.16 90 top
U58  TypeC-16PIN  [USB-C-SMD_TYPE-C-6PIN-2MD-073]  64.77 26.85 90 top
U59  CAN  [CONN-TH_DB301V-3.5-2P-GN]  66.65 41.58 90 top
U60  10kΩ  [R0805]  19.05 37.15 270 top
U61  10kΩ  [R0805]  24.51 37.15 90 top
U62  1kΩ  [R0805]  26.54 37.15 90 top
U63  ZX-XH2.54-4PZZ  [CONN-TH_4P-P2.50_4PIN]  38.61 54.79 0 top
U64  140Ω  [R0603]  30.83 48.57 180 top

## Footprints (pads in the part's own frame, mm; a bottom-side part is the same pattern mirrored in y, then rotated)
C0603
  rect 0.8x0.9 smd: 1(-0.7,0) 2(0.7,0)
C0805
  rect 1.41x1.35 smd: 1(-1,0) 2(1,0)
CONN-TH_4P-P2.50_4PIN
  rect 1.524x1.6 hole 1.1: 1(-3.75,0)
  round 1.6 hole 1.1: 2(-1.25,0) 3(1.25,0) 4(3.75,0)
CONN-TH_DB301V-3.5-2P-GN
  round 1.8 hole 1.1: 1(-1.75,0) 2(1.75,0)
Conn_01x30
  rect 0.4x2 smd: 1(0.359,-1.253) 2(1.06,-1.253) 3(1.76,-1.253) 4(2.459,-1.253) 5(3.159,-1.253) 6(3.86,-1.253) 7(4.559,-1.253) 8(5.26,-1.253) 9(5.96,-1.253) 10(6.66,-1.253) 11(7.359,-1.253) 12(8.059,-1.253) 13(8.759,-1.253) 14(9.46,-1.253) 15(10.159,-1.253) 16(10.86,-1.253) 17(11.559,-1.253) 18(12.259,-1.253) 19(12.96,-1.253) 20(13.659,-1.253) 21(14.36,-1.253) 22(15.059,-1.253) 23(15.759,-1.253) 24(16.459,-1.253) 25(17.16,-1.253) 26(17.86,-1.253) 27(18.559,-1.253) 28(19.259,-1.253) 29(19.959,-1.253) 30(20.66,-1.253)
DC-IN-TH_DC005
  oval 2x4.6 hole 1.2x3.7: 1(3.1,2.35) 2(-3.1,2.35)
  oval 4.6x2 hole 3.7x1.2: 3(0.1,-2.35)
HDR-TH_3P-P2.54-V-M
  rect 1.7x1.7 hole 1.1: 1(-2.54,0)
  round 1.7 hole 1.1: 2(0,0) 3(2.54,0)
LED_0805
  rect 1x1.25 smd: 1(-1.15,0.005) 2(1.05,0.005)
OPTO-SMD-5_L3.7-W4.6-P1.27-LS7.0-BR
  oval 2x0.65 smd: 1(3.15,-1.27) 3(3.175,1.27) 4(-3.15,1.27) 5(-3.175,0) 6(-3.15,-1.27)
Pad_e93
  round 2.032 smd: 42(0,0)
Pad_e132
  round 2.032 smd: 43(0,0)
PWRM-TH_BXXXXS-1W
  rect 1.6x1.6 hole 1: 1(-3.81,0)
  round 1.6 hole 1: 2(-1.27,0) 3(1.27,0) 4(3.81,0)
R0402
  rect 0.566x0.54 smd: 1(-0.433,0) 2(0.433,0)
R0603
  rect 0.806x0.864 smd: 1(-0.753,0) 2(0.753,0)
R0805
  rect 1.133x1.377 smd: 1(-1,0) 2(1,0)
SOP-8_L4.9-W3.9-P1.27-LS6.0-BL-1
  oval 0.63x1.865 smd: 1(-1.905,-2.683) 2(-0.635,-2.683) 3(0.635,-2.683) 4(1.905,-2.683) 5(1.905,2.683) 6(0.635,2.683) 7(-0.635,2.683) 8(-1.905,2.683)
SOT-23-3_L3.0-W1.7-P0.95-LS2.9-BR
  rect 1.038x0.532 smd: 1(1.101,-0.95) 2(1.101,0.95) 3(-1.101,0)
SOT-89_L4.5-W2.5-P1.50-LS4.2-BR
  rect 1.575x0.672 smd: 1(1.356,-1.5) 3(1.356,1.5)
  custom 5.377x1.9 smd: 2(-1.356,0.009)
SW-SMD_4P-L5.1-W5.1-P3.70-LS6.4
  rect 1.5x0.8 smd: 1(-3.291,1.85) 2(3.291,1.85) 3(-3.291,-1.85) 4(3.291,-1.85)
test-point-0.5mm
  round 0.762 smd: 1(0,0)
TFT_1.54_12P
  rect 0.4x2 smd: 1(19.605,-23.07) 2(18.905,-23.07) 3(18.206,-23.07) 4(17.506,-23.07) 5(16.805,-23.07) 6(16.105,-23.07) 7(15.405,-23.07) 8(14.706,-23.07) 9(14.005,-23.07) 10(13.306,-23.07) 11(12.605,-23.07) 12(11.905,-23.07)
USB-C-SMD_TYPE-C-6PIN-2MD-073
  rect 0.6x1.1 smd: 1(-3.2,2.375) 2(-2.4,2.375) 11(2.4,2.375) 12(3.2,2.375)
  rect 0.3x1.1 smd: 3(-1.75,2.375) 4(-1.25,2.375) 5(-0.75,2.375) 6(-0.25,2.375) 7(0.25,2.375) 8(0.75,2.375) 9(1.25,2.375) 10(1.75,2.375)
  oval 1.2x2 hole 0.6x1.5: 13(-4.325,1.825) 14(4.325,1.825)
  oval 1.2x1.8 hole 0.6x1.2: 13(-4.325,-2.375) 14(4.325,-2.375)
WIRELM-SMD_ESP32-S3-WROOM-1
  rect 1.5x0.9 smd: 1(-8.75,8.895) 2(-8.75,7.625) 3(-8.75,6.355) 4(-8.75,5.085) 5(-8.75,3.815) 6(-8.75,2.545) 7(-8.75,1.275) 8(-8.75,0.005) 9(-8.75,-1.265) 10(-8.75,-2.535) 11(-8.75,-3.805) 12(-8.75,-5.075) 13(-8.75,-6.345) 14(-8.75,-7.615) 27(8.75,-7.615) 28(8.75,-6.345) 29(8.75,-5.075) 30(8.75,-3.805) 31(8.75,-2.535) 32(8.75,-1.265) 33(8.75,0.005) 34(8.75,1.275) 35(8.75,2.545) 36(8.75,3.815) 37(8.75,5.085) 38(8.75,6.355) 39(8.75,7.625) 40(8.75,8.895)
  rect 0.9x1.5 smd: 15(-6.985,-8.895) 16(-5.715,-8.895) 17(-4.445,-8.895) 18(-3.175,-8.895) 19(-1.905,-8.895) 20(-0.635,-8.895) 21(0.635,-8.895) 22(1.905,-8.895) 23(3.175,-8.895) 24(4.445,-8.895) 25(5.715,-8.895) 26(6.985,-8.865)
  rect 0.9x0.9 smd: 41(-2.9,2.575) 41(-2.9,1.175) 41(-2.9,-0.225) 41(-1.5,2.575) 41(-1.5,1.175) 41(-1.5,-0.225) 41(-0.1,2.575) 41(-0.1,1.175) 41(-0.1,-0.225)

## Nets
As in the schematic, except:
GND: C1.2 C2.1 C4.2 LED2.1 NOREF#2.43 Q1.2 R1.1 R2.1 R3.1 R5.1 SW1.3 SW1.4 SW2.3 SW2.4 SW3.3 SW3.4 SW4.1 SW4.2 U1.1 U1.40 U1.41 U2.2 U2.8 U4.1 U4.8 U4.10 U4.12 U4.16 U4.17 U4.21 U4.22 U4.23 U4.24 U4.25 U4.29 U4.30 U5.1 U5.5 U5.6 U5.12 U39.2 U40.1 U41.2 U42.2 U45.1 U46.1 U47.1 U48.1 U49.2 U56.3 U58.1 U58.12 U58.13 U58.14 U64.2
NTC1: NOREF.42 U1.39 U21.2

Pads without a net: U1 6 8 10 11 12 15 24 25 26 28 29 30 31 32 33 34 35 36 37 38; U4 7 20; U58 3 9

## Via types
v1: diameter 0.61, hole 0.305, Top Layer to Bottom Layer, 150 vias

## Routing (per net, layer and track width the routed paths; a pad name or vN(x,y) marks a point on that pad's centre or on a via; arc(x,y) is an arc through that point)
0V: length 59.3
  Top Layer w0.508: U56.1 46.05,39.35 42.93,42.47 42.93,46.28 41.91,47.3 41,47.3 ; 41,47.3 U53.4 35.31,47.3 34.8,47.81 34.8,54.79 ; 41,47.3 41,48.25
  Bottom Layer w1.016: 62.17,55.47 62.04,55.34 DC1.2 ; 62.17,55.47 62.17,55.59 ; 62.17,55.47 59.1,58.54 59.1,58.67 ; 34.8,54.79 34.8,57.08 36.58,58.86 58.66,58.86 58.84,58.67
+3V3: length 113.2
  Top Layer w0.254: U45.2 36.17,38.05 ; 36.17,38.05 36.17,38.06 v1(35.16,39.07) 34.15,38.05 U46.2 ; 36.17,38.05 36.17,36.91 36.78,36.3 36.78,25.58 ; U21.1 28.83,54.21 v1(28.32,54.72) ; 9.65,38.95 C2.2 ; 9.65,38.95 U1.2 ; 9.65,38.95 9.65,37.14 C1.1 ; 36.78,25.58 U4.6 ; 36.78,25.58 35.05,25.58 34.68,25.21 U4.9 34.68,20.55 35.61,19.61 37.25,19.61 37.25,19 U5.4
  Top Layer w0.508: 55.32,41.84 57.53,41.84 57.53,43.84 57.5,43.87 U2.5 ; 55.32,41.84 v1(54.61,41.84) ; 55.32,41.84 U40.3 ; 24.46,39.17 v1(25.65,39.17) ; 24.46,39.17 24.46,38.2 U61.2 ; 24.46,39.17 17.91,39.17 17.53,38.79 17.53,36.69 U6.1 16.24,35.65 15.7,35.11 10.67,35.11 9.91,35.87 C1.1
  Bottom Layer w0.254: v1(28.32,54.72) 24.44,54.72 22.86,53.14 22.86,44.38 25.6,41.64 25.6,39.44 25.65,39.39 v1(25.65,39.17)
  Bottom Layer w0.508: v1(25.65,39.17) 25.76,39.07 v1(35.16,39.07) 36.21,38.03 49.02,38.03 52.83,41.84 v1(54.61,41.84)
+5V: length 22.5
  Top Layer w0.381: H1.2 53.5,52.35 53.5,45.14 ; U2.3 53.5,45.14 ; 53.5,45.14 53.5,41.37 U40.2 52.61,37.13 U41.1
+12V: length 38.7
  Top Layer w0.508: 42.42,54.79 42.42,49.71 ; 42.42,49.71 44.13,49.71 44.58,49.26 44.58,43.71 46.4,41.89 U56.2 ; 42.42,49.71 40.94,49.71 ; 40.94,49.71 40.22,49.71 40.1,49.84 U53.6 ; 40.94,49.71 C3.1
  Bottom Layer w1.016: DC1.1 55.84,56.86 55.37,57.33 43.69,57.33 42.42,56.06 42.42,54.79
GND: length 95.6
  Top Layer w0.254: 16.1,47.07 U1.41 U1.41 ; 16.1,47.07 16.1,48.47 ; 16.1,47.07 U1.41 U1.41 ; U41.2 55.12,36.9 v1(55.12,38.03) 55.12,38.77 U40.1 ; U42.2 57.04,39.82 v1(56.13,38.92) ; SW4.1 v1(35.08,44.83) SW4.2 ; 16.1,49.87 16.1,48.47 ; 16.1,49.87 U1.41 U1.41 ; 16.1,49.87 U1.41 U1.41 ; v1(19.94,24.95) 19.94,25.01 19.98,25.05 U4.30 U4.29 ; 16.1,48.47 U1.41 ; 16.1,48.47 U1.41 ; U5.6 37.27,17.58 37.27,18.22 v1(35.69,18.22) ; C2.1 11.81,38.19 v1(11.81,37.9) 11.91,37.81 C1.2 ; 8.38,58.72 8.38,58.71 v1(8.38,57.97) ; U4.23 U4.24 U4.25 ; U4.23 24.88,24.81 v1(24.89,24.82) ; U4.23 U4.22 U4.21 ; v1(38.99,21.52) 38.53,21.06 U5.1 ; 40.64,25.46 40.28,25.1 U4.1 ; U5.12 36.04,13.36 v1(35.81,13.14) ; v1(34.04,24.82) 33.98,24.77 U4.10 ; U48.1 v1(52.47,4.74) U49.2 v1(52.47,6.86) U47.1 52.41,7.99 v1(52.41,9.05) 52.34,9.12 R1.1 ; v1(8.38,41.97) 8.38,41.22 8.38,41.22 ; v1(29.72,24.95) 29.78,24.89 U4.16 U4.17 ; v1(9.4,29.9) 8.91,29.42 8.91,29.26 ; 3.31,23.22 6.42,23.22 v1(6.48,23.17) 6.53,23.22 9.89,23.22 ; R3.1 59.64,25.53 v1(59.31,25.2) ; Q1.2 22.76,38.16 v1(21.84,38.16) ; U45.1 38.19,36.92 v1(38.23,36.89) ; U4.8 35.38,24.77 v1(35.43,24.82) ; 9.89,15.54 6.49,15.54 v1(6.48,15.55) 6.47,15.54 3.31,15.54 ; v1(32.64,24.82) 32.58,24.76 U4.12 ; v1(16.76,37.9) 16.76,38.39 U39.2 ; v1(59.13,28.56) R5.1 ; SW3.3 3.37,7.8 v1(6.6,7.8) 6.66,7.86 SW3.4 ; v1(30.99,38.03) 31.01,38.05 U46.1 ; v1(35.05,35.87) R2.1 ; U2.8 v1(56.01,47.68) ; NOREF#2.43 31.12,58.73 v1(32.38,58.73)
  Top Layer w0.381: v1(30.03,47.77) 30.08,47.81 U64.2 ; U56.3 48.68,44.43 C4.2
  Top Layer w0.508: U58.12 62.94,30.6 62.94,31.18 ; 62.94,22.53 62.94,23.1 U58.1
  vias: v1(5.08,35.56) v1(5.08,30.48) v1(5.08,25.4) v1(5.08,20.32) v1(5.08,10.16) v1(5.08,5.08) v1(10.16,55.88) v1(10.16,50.8) v1(10.16,45.72) v1(10.16,30.48) v1(10.16,25.4) v1(10.16,20.32) v1(10.16,10.16) v1(10.16,5.08) v1(15.24,55.88) v1(15.24,50.8) v1(15.24,30.48) v1(15.24,25.4) v1(15.24,20.32) v1(15.24,15.24) v1(15.24,10.16) v1(15.24,5.08) v1(20.32,50.8) v1(20.32,30.48) v1(20.32,20.32) v1(20.32,15.24) v1(20.32,10.16) v1(20.32,5.08) v1(25.4,25.4) v1(25.4,20.32) v1(25.4,15.24) v1(25.4,5.08) v1(30.48,55.88) v1(30.48,45.72) v1(30.48,35.56) v1(30.48,15.24) v1(30.48,5.08) v1(35.56,50.8) v1(35.56,45.72) v1(35.56,30.48) v1(35.56,5.08) v1(40.64,50.8) v1(40.64,45.72) v1(40.64,40.64) v1(40.64,35.56) v1(40.64,25.46) v1(40.64,20.32) v1(40.64,15.24) v1(40.64,5.08) v1(45.72,55.88) v1(45.72,50.8) v1(45.72,45.72) v1(45.72,35.56) v1(45.72,20.32) v1(45.72,15.24) v1(45.72,5.08) v1(50.67,46.41) v1(50.8,50.8) v1(50.8,35.56) v1(50.8,20.32) v1(50.8,15.24) v1(55.88,50.8) v1(55.88,45.72) v1(55.88,35.56) v1(55.88,30.48) v1(55.88,20.32) v1(55.88,15.24) v1(55.88,10.16) v1(55.88,5.08) v1(60.96,50.8) v1(60.96,45.72) v1(60.96,20.32) v1(60.96,15.24) v1(60.96,10.16) v1(60.96,5.08) v1(66.04,55.88) v1(66.04,50.8) v1(66.04,45.72) v1(66.04,35.56) v1(66.04,25.4) v1(66.04,20.32) v1(66.04,15.24) v1(66.04,10.16) v1(66.04,5.08)
VBUS: length 39
  Top Layer w0.254: U58.2 62.38,24.44 v1(61.72,24.44) ; v1(61.7,29.25) U58.11
  Bottom Layer w0.381: H1.3 52.77,52.32 61.27,43.82 61.27,29.69 v1(61.7,29.25) 62.12,29.25 64.13,27.23 64.13,25.96 62.61,24.44 v1(61.72,24.44)
BLK: length 8.7
  Top Layer w0.254: U1.17 26.8,45.52 27.25,45.06 27.25,39.63 26.54,38.92 26.54,38.09 26.62,38.01
CAN_RX: length 48.9
  Top Layer w0.254: U1.4 12.19,43.36 14.22,45.39 19.43,45.39 v1(23.88,49.84) ; v1(50.55,43.87) U2.4
  Bottom Layer w0.254: v1(50.55,43.87) 48.77,43.87 48.51,44.12 48.51,47.3 46.5,49.32 24.13,49.32 23.88,49.57 v1(23.88,49.84)
CAN_TX: length 44.3
  Top Layer w0.254: v1(50.67,47.68) U2.1 ; 13.46,41.22 13.46,43.36 14.48,44.38 19.43,44.38 24.76,49.71 v1(24.76,49.97)
  Bottom Layer w0.254: v1(24.76,49.97) 46.74,49.97 49.02,47.68 v1(50.67,47.68)
CANH: length 12.9
  Top Layer w0.254: U59.2 65.9,42.58 U3.2 60.08,45.13 58.8,46.41 U2.7
CANL: length 13.9
  Top Layer w0.254: U2.6 58.42,45.14 59.06,44.51 59.06,40.84 59.31,40.58 U3.1 65.9,40.58 U59.1
D+: length 51.7
  Top Layer w0.254: U58.8 61.5,27.6 61.49,27.61 v1(61.37,27.61) 61.37,26.78 61.54,26.6 U58.6
  Bottom Layer w0.254: v1(25.02,40.57) 25.02,35.23 33.63,26.62 62.48,26.62 62.74,26.88 62.74,27.38 62.51,27.61 v1(61.37,27.61)
D-: length 51.7
  Top Layer w0.254: U58.5 63.28,26.1 63.42,26.24 v1(63.42,26.6) 63.42,26.93 63.25,27.1 U58.7
  Bottom Layer w0.254: v1(23.88,40.7) 23.88,35.49 33.2,26.17 62.99,26.17 v1(63.42,26.6)
ESP_EN: length 32
  Top Layer w0.254: U1.3 10.92,40.83 12.83,38.92 14.24,38.92 ; U6.2 14.24,36.69 14.24,38.92 ; 14.24,38.92 U39.1 15.26,39.93 v1(26.29,39.93) ; SW4.4 SW4.3 31.31,41.13 v1(30.99,41.46)
  Bottom Layer w0.254: v1(26.29,39.93) 28.45,39.93 29.97,41.46 v1(30.99,41.46)
FAN_CTL: length 7.4
  Top Layer w0.254: U53.1 32.17,49.91 28.93,53.14 U1.23
FAN_SPED: length 9.1
  Top Layer w0.254: FAN_SPEED.1 38.16,59.18 37.34,58.35 37.34,54.79
KEY_1: length 46.6
  Top Layer w0.254: U1.27 24.89,58.71 v1(24.89,57.97) ; SW1.1 SW1.2 11.12,26.92 v1(11.68,27.49)
  Bottom Layer w0.254: v1(11.68,27.49) 11.68,35.62 17.78,41.71 17.78,42.35 18.92,43.49 18.92,54.28 22.61,57.97 v1(24.89,57.97)
KEY_2: length 33.8
  Top Layer w0.254: v1(11.68,19.61) 11.31,19.24 SW2.2 SW2.1
  Bottom Layer w0.254: v1(11.68,19.61) 12.27,20.2 12.27,35.38 18.54,41.65 v1(18.54,42.01)
KEY_3: length 49.5
  Top Layer w0.254: v1(20.19,42.73) 21.72,44.25 U1.16 ; SW3.1 SW3.2 11.37,11.56 v1(11.81,11.99)
  Bottom Layer w0.254: v1(20.19,42.73) 20.19,42.47 12.8,35.08 12.8,12.98 v1(11.81,11.99)
LED: length 15.6
  Top Layer w0.254: v1(6.48,33.97) U27.1
  Bottom Layer w0.254: v1(6.48,33.97) 6.48,37.39 11.05,41.97 v1(16.13,41.97)
LEDK: length 24.8
  Top Layer w0.254: v1(20.96,35.11) 19.92,36.15 U60.2 ; v1(35.56,20.88) 36.09,20.36 U5.2
  Bottom Layer w0.254: v1(35.56,20.88) 35.18,20.88 v1(20.96,35.11)
NTC1: length 22.5
  Top Layer w0.254: v1(9.65,57.97) 9.65,58.71 U1.39 ; U21.2 28.83,58.09 NOREF.42 28.19,58.73 v1(27.05,58.73)
  Bottom Layer w0.254: v1(27.05,58.73) 26.92,58.86 10.54,58.86 v1(9.65,57.97)
OLED_VCOMH: length 40.2
  Top Layer w0.254: U4.27 22.1,23.26 22.1,14.03 28.18,7.94 U47.2
S_+5V: length 11.5
  Top Layer w0.381: 47.69,46.97 U56.4 ; 47.69,46.97 47.24,47.41 47.24,55.17 H1.1 ; 47.69,46.97 47.69,46.8 48.14,46.35 C4.1
SPI_CS: length 38.7
  Top Layer w0.254: U5.8 37.27,16.19 v1(36.19,16.19) ; v1(29.69,46.54) 29.69,30.56 31.88,28.37 31.88,23.28 U4.13 31.88,22.15 32.77,21.27 v1(33.02,21.27) ; U1.18 26.8,46.79 v1(27.05,46.54)
  Bottom Layer w0.254: v1(29.69,46.54) v1(27.05,46.54) ; v1(33.02,21.27) 34.29,21.27 34.93,20.63 34.93,17.45 v1(36.19,16.19)
SPI_D/C: length 40.8
  Top Layer w0.254: U5.7 34.63,16.86 30.48,21.01 U4.15 30.48,28.5 28.57,30.41 28.57,49.71 27.69,50.6 U1.21
SPI_RES: length 44.9
  Top Layer w0.254: v1(33.78,20.63) 32.77,20.63 31.18,22.22 U4.14 31.18,28.44 29.08,30.54 29.08,50.73 27.94,51.87 U1.22 ; v1(35.81,14.15) 35.91,14.06 U5.11
  Bottom Layer w0.254: v1(35.81,14.15) 35.38,14.58 35.38,16.11 34.29,17.2 34.29,20.12 v1(33.78,20.63)
SPI_SCLK: length 40.5
  Top Layer w0.254: U5.9 35.07,15.46 28.38,22.15 U4.18 28.38,29.61 28.13,29.87 28.13,48.64 27.43,49.33 U1.20
SPI_SDIN: length 40
  Top Layer w0.254: U1.19 26.29,47.94 27.47,47.94 27.68,47.72 U4.19 27.68,22.03 34.95,14.76 U5.10
$1N1911: length 14.4
  Top Layer w0.254: U4.2 39.58,25.91 39.83,26.17 46.91,26.17 49.13,23.95 U43.1
$1N1912: length 14.7
  Top Layer w0.254: U43.2 47.63,25.95 47.06,26.52 39.29,26.52 38.86,26.09 38.86,23.3 U4.3
$1N1913: length 16.8
  Top Layer w0.254: U4.4 38.18,27.67 38.77,28.27 U44.2
$1N1914: length 19.2
  Top Layer w0.254: U4.5 37.48,29.28 38.47,30.27 U44.1
$1N1920: length 38.1
  Top Layer w0.254: U4.26 22.78,14.49 27.09,10.17 R1.2
$1N1926: length 44
  Top Layer w0.254: U48.2 U49.1 29.3,5.81 21.38,13.73 U4.28
$1N1927: length 13.1
  Top Layer w0.254: R2.2 32.05,34.93 33.28,33.7 U4.11
$1N1975: length 2.1
  Top Layer w0.254: 6.71,29.26 6.71,31.06 U27.2
$1N2447: length 8.6
  Top Layer w0.254: U53.5 37.34,48.57 37.08,48.82 37.08,52 39.88,54.79
$1N3071: length 1.9
  Top Layer w0.254: U58.4 60.61,25.6 R3.2
$1N3072: length 1.9
  Top Layer w0.254: U58.10 60.55,28.6 R5.2
$1N9419: length 2
  Top Layer w0.254: Q1.3 20.43,37.15 19.44,38.15 U60.1
$1N9466: length 3.7
  Top Layer w0.254: Q1.1 23.18,36.2 23.23,36.15 U61.1 U62.1
$1N12402: length 1.6
  Top Layer w0.254: U53.3 32.26,47.3
  Top Layer w0.381: U64.1 32.14,48.01 U53.3

## Copper pours and planes (outline as drawn; the poured copper is in the pictures)
GND on Bottom Layer: 0,60 70,60 70,0 0,0

Small or netless copper shapes (teardrops, artwork), in the pictures only: 318 on Top Layer, 44 on Bottom Layer

## Text on the board
Top Silkscreen Layer: 1 | 2 | 3 | L | H | JLCJLCJLCJLC | 2-3 | 1-2 | Type-C | DC+ | TFT 1.45 | OLED 1.3 | PowerControl | ESP32开发板 | Ver: 1.3
